# EAGLE design FanController_v1 (EAGLE 6.4)
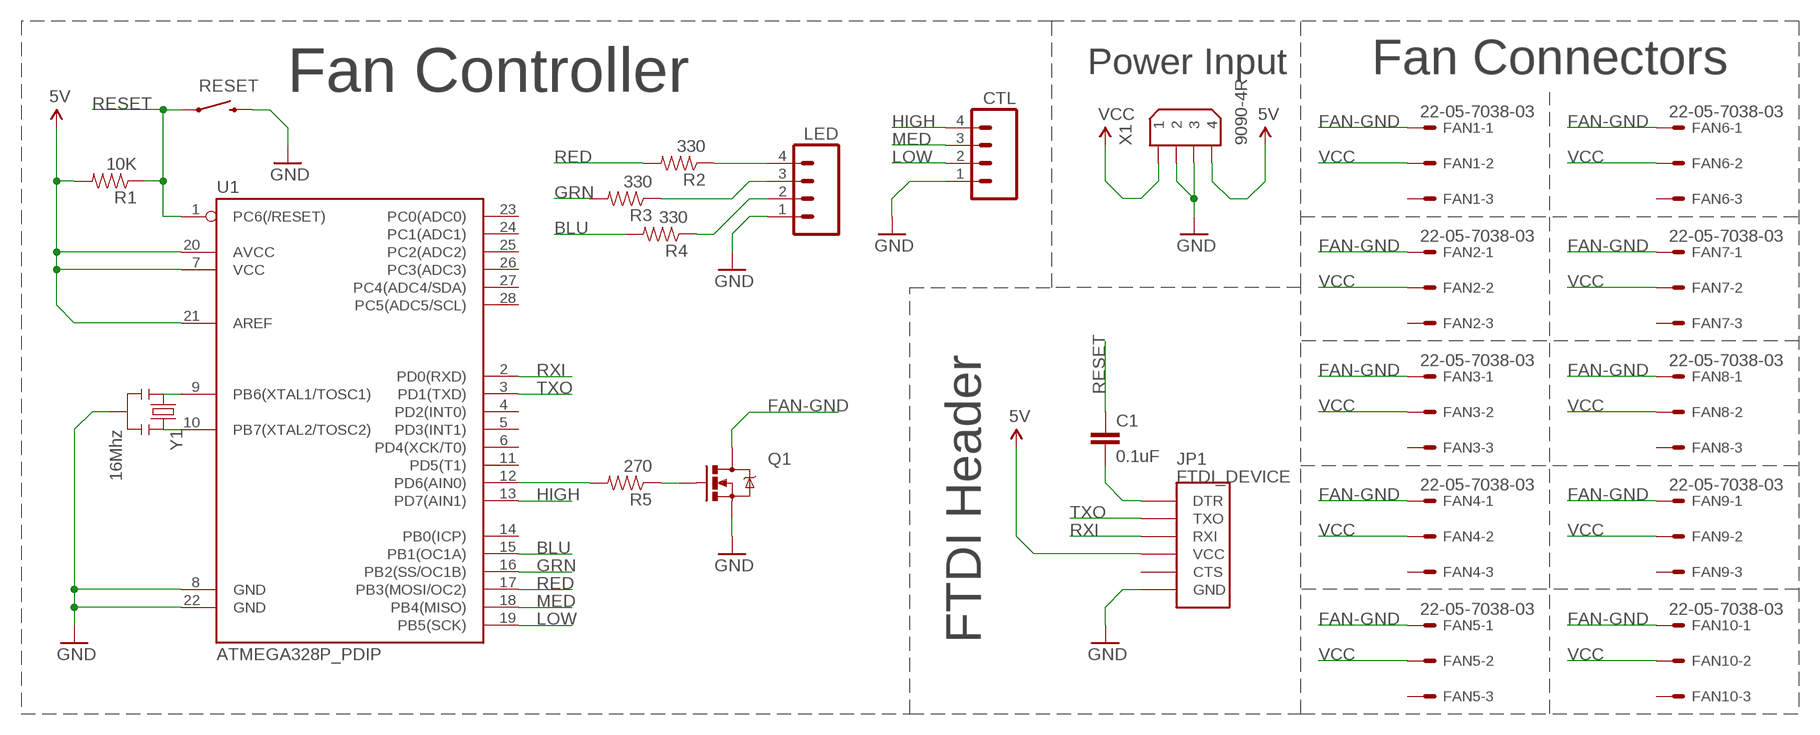
[diagram p0: schematic, sheet 1]

## Parts
C1  0.1uF  CAPPTH  [CAP-PTH-SMALL]
CTL  M04PTH  [1X04]
FAN1  22-05-7038-03  [7395-03]
FAN2  22-05-7038-03  [7395-03]
FAN3  22-05-7038-03  [7395-03]
FAN4  22-05-7038-03  [7395-03]
FAN5  22-05-7038-03  [7395-03]
FAN6  22-05-7038-03  [7395-03]
FAN7  22-05-7038-03  [7395-03]
FAN8  22-05-7038-03  [7395-03]
FAN9  22-05-7038-03  [7395-03]
FAN10  22-05-7038-03  [7395-03]
JP1  FTDI_DEVICE  [FTDI_DEVICE_SIDE]
LED  M04PTH  [1X04]
Q1  MOSFET-NCHANNELFQP30N06L  [TO220V]
R1  10K  RESISTORPTH-1/4W  [AXIAL-0.4]
R2  330  RESISTORPTH-1/4W  [AXIAL-0.4]
R3  330  RESISTORPTH-1/4W  [AXIAL-0.4]
R4  330  RESISTORPTH-1/4W  [AXIAL-0.4]
R5  270  RESISTORPTH-1/4W  [AXIAL-0.4]
RESET  SWITCH-MOMENTARY-2PTH  [TACTILE-PTH]
U1  ATMEGA328P_PDIP  [DIL28-3]
X1  9090-4R  [9090-4R]
Y1  16Mhz  RESONATORPTH  [RESONATOR-PTH]

## Nets
5V: JP1.P$4(VCC) R1.P$2 U1.7(VCC) U1.20(AVCC) U1.21(AREF) X1.4
BLU: R4.P$2 U1.15(PB1(OC1A))
FAN-GND: FAN1.1 FAN2.1 FAN3.1 FAN4.1 FAN5.1 FAN6.1 FAN7.1 FAN8.1 FAN9.1 FAN10.1 Q1.2(D)
GND: CTL.1 JP1.P$6(GND) LED.1 Q1.3(S) RESET.3 U1.8(GND) U1.22(GND) X1.2 X1.3 Y1.2
GRN: R3.P$2 U1.16(PB2(SS/OC1B))
HIGH: CTL.4 U1.13(PD7(AIN1))
LOW: CTL.2 U1.19(PB5(SCK))
MED: CTL.3 U1.18(PB4(MISO))
N$1: U1.10(PB7(XTAL2/TOSC2)) Y1.3
N$2: U1.9(PB6(XTAL1/TOSC1)) Y1.1
N$3: C1.2 JP1.P$1(DTR)
N$4: LED.4 R2.P$1
N$5: LED.3 R3.P$1
N$6: LED.2 R4.P$1
N$7: R5.P$2 U1.12(PD6(AIN0))
N$8: Q1.1(G) R5.P$1
RED: R2.P$2 U1.17(PB3(MOSI/OC2))
RESET: C1.1 R1.P$1 RESET.1 U1.1(PC6(/RESET))
RXI: JP1.P$3(RXI) U1.2(PD0(RXD))
TXO: JP1.P$2(TXO) U1.3(PD1(TXD))
VCC: FAN1.2 FAN2.2 FAN3.2 FAN4.2 FAN5.2 FAN6.2 FAN7.2 FAN8.2 FAN9.2 FAN10.2 X1.1
Unconnected: FAN1.3 FAN2.3 FAN3.3 FAN4.3 FAN5.3 FAN6.3 FAN7.3 FAN8.3 FAN9.3 FAN10.3 JP1.P$5(CTS) U1.4(PD2(INT0)) U1.5(PD3(INT1)) U1.6(PD4(XCK/T0)) U1.11(PD5(T1)) U1.14(PB0(ICP)) U1.23(PC0(ADC0)) U1.24(PC1(ADC1)) U1.25(PC2(ADC2)) U1.26(PC3(ADC3)) U1.27(PC4(ADC4/SDA)) U1.28(PC5(ADC5/SCL))

## Notes on the sheet
- Power Input | Fan Connectors
- Fan Controller
- FTDI Header

## Library data of the parts
C1 = SparkFun-Capacitors:CAP: Capacitor Standard 0603 ceramic capacitor, and 0.1" leaded capacitor.
CTL LED = SparkFun-Connectors:M04: Header 4 Standard 4-pin 0.1" header. Use with straight break away headers (SKU : PRT-00116), right angle break away headers (PRT-00553), swiss pins (PRT-00743), machine pins (PRT-00117), and female headers (PRT-00115). Molex polarized connector foot print use with SKU : PRT-08231 with associated crimp pins and housings. 1MM SMD Version SKU: PRT-10208
FAN1-FAN10 = con-molex:22-?-03: CONNECTOR wire to board 2.54 mm (.1 inch) pitch header; OC_FARNELL: unknown; OC_NEWARK: unknown
JP1 = SparkFun-Connectors:FTDI_DEVICE: Connector which mates to FTDI basic or FTDI cable.
Q1 = SparkFun-DiscreteSemi:MOSFET-NCHANNEL: Common NMOSFET Parts MFG P/N Store ID Prod ID FDD8780 TRANS-09984 SI7820DN TRANS-11055 FDS6630A IC-08089 2N7002PW TRANS-11151 FQP30N06L COM-10213 TRANS-10060 BSS123LT1G TRANS-08345 BSS138 TRANS-00830 BS170 2N7000; PROD_ID: TRANS-10060
R1-R5 = SparkFun-Passives:RESISTOR: Resistor Basic schematic elements and footprints for 0603, 1206, and PTH resistors.
RESET = SparkFun-Electromechanical:SWITCH-MOMENTARY-2: Various NO switches- pushbuttons, reed, etc
U1 = SparkFun-DigitalIC:ATMEGA328P_PDIP: uC used in the Arduino 32kb flash, 1k EEPROM, 2k SRAM This is the through-hole version of this chip.
X1 = con-thomas-betts:9090-4: Disk Drive Power four position Source: Thomas & Betts Electronic Interconnects Eiropean Edition 1998; OC_FARNELL: unknown; OC_NEWARK: unknown
Y1 = SparkFun-FreqCtrl:RESONATOR: Resonator Small SMD resonator. Used, eg, on the Arduino Pro/ Pro Mini boards. 8MHz- XTAL-08895 16MHz- XTAL-08900

## Board
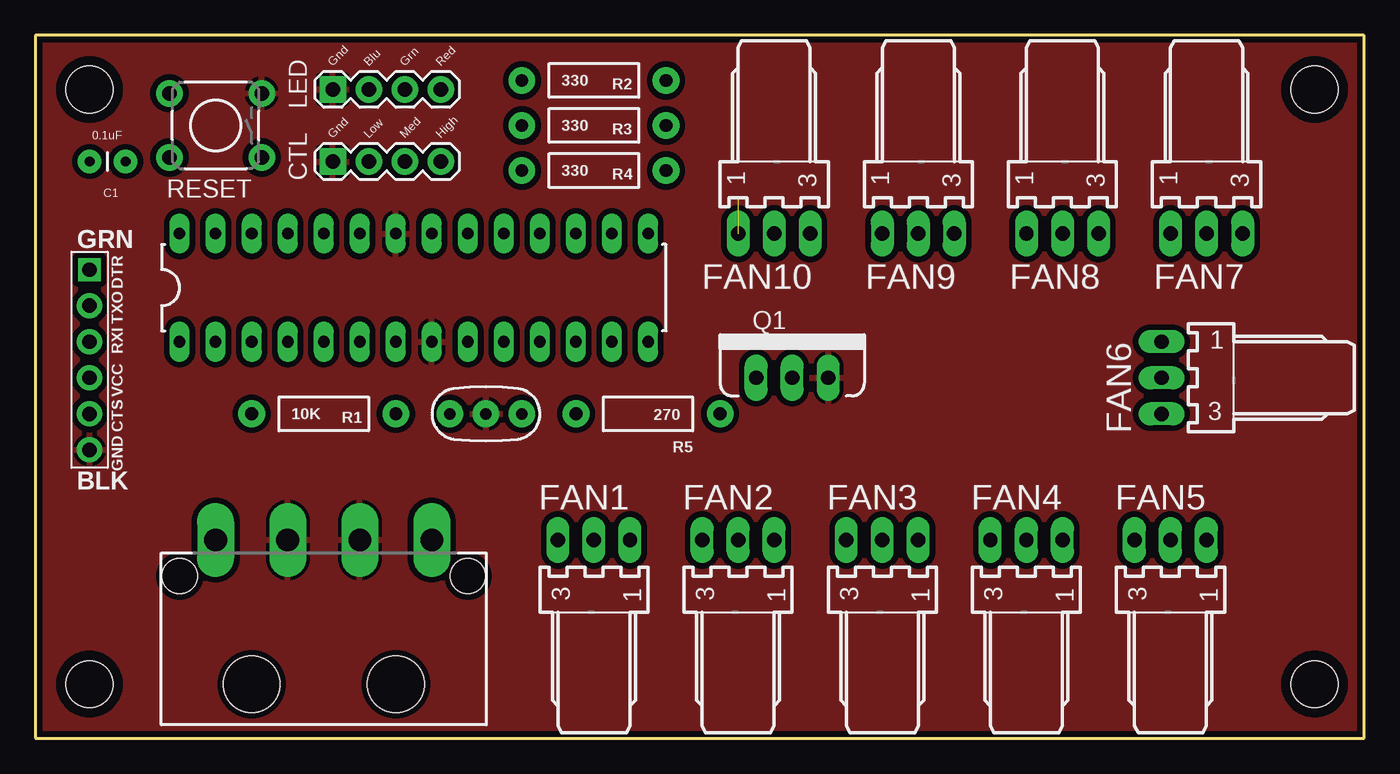
[diagram p1: board, top side]
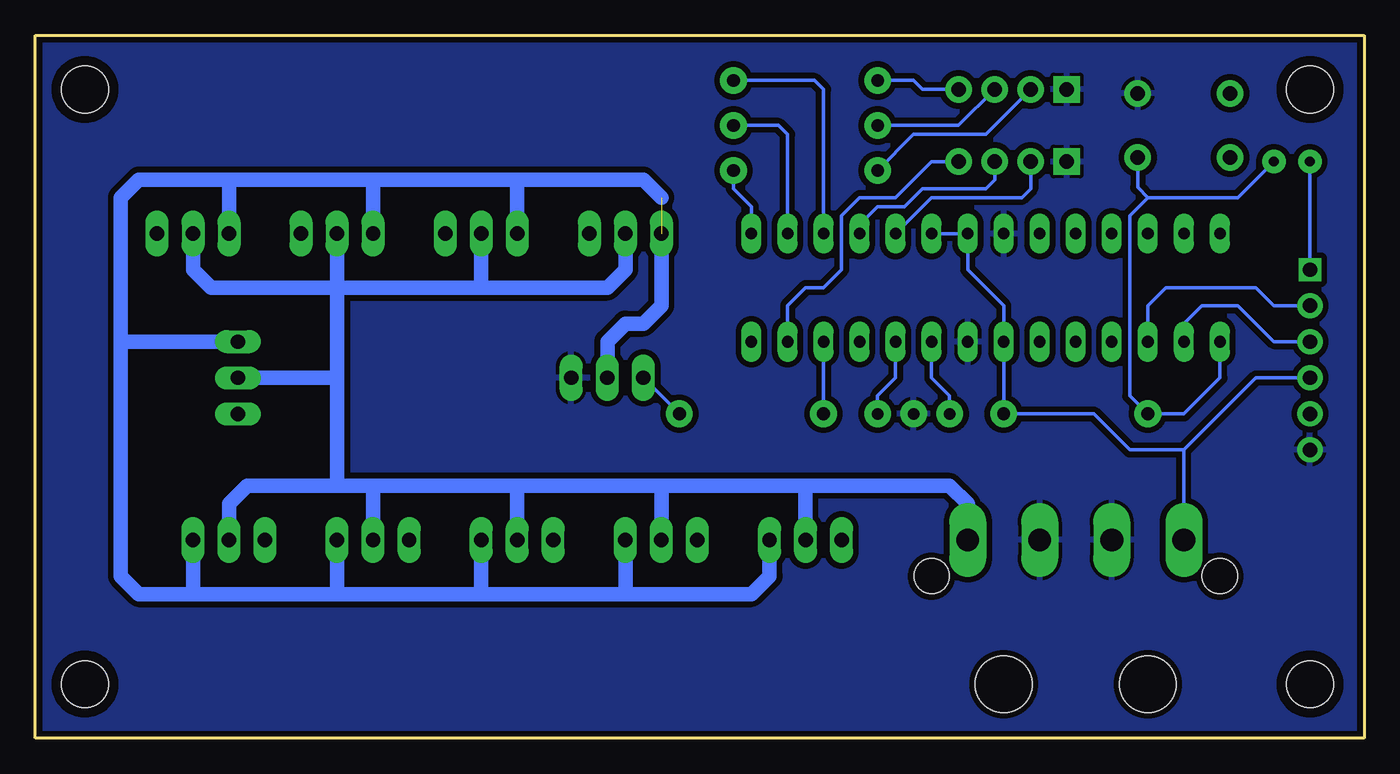
[diagram p2: board, bottom side, seen from below]

Size 93.65 x 49.52 mm. Coordinates in mm from the lower left corner, seen from the top.
Outline: 0,0 93.65,0 93.65,49.52 0,49.52 0,0
Copper layers (1*16): Top 0.035mm / dielectric 1.5mm / Bottom 0.035mm
Design rules "SparkFun": minimum track width 8mil, minimum drill 20mil, track to track 8mil, track to pad 8mil, pad to pad 8mil, via to via 8mil, smd to smd 8mil, copper to edge 10mil, drill to drill 8mil, minimum pad ring 12mil, minimum via ring 10mil, stop-mask expansion 4mil, vias tented up to drill 25mil, thermal gap 10mil

### Footprints (pad centres in the part's own frame; a part is rotated, then mirrored left to right if it is on the bottom)
CAP-PTH-SMALL = drill 0.7 pad 1.651: 1 0,0; 2 2.54,0
1X04 = drill 1.016 pad 1.88 square: 1 0,0 | drill 1.016 pad 1.88: 2 2.54,0; 3 5.08,0; 4 7.62,0
7395-03 = drill 1.016 long: 1 2.54,0; 2 0,0; 3 -2.54,0
FTDI_DEVICE_SIDE = drill 1 square: P$1 -6.35,0 | drill 1.016 pad 1.778: P$2 -3.81,0; P$3 -1.27,0; P$4 1.27,0; P$5 3.81,0; P$6 6.35,0
TO220V = drill 1.016 long: 1 -2.54,0; 2 0,0; 3 2.54,0
AXIAL-0.4 = drill 0.9 pad 1.88: P$1 -5.08,0; P$2 5.08,0
TACTILE-PTH = drill 1.016 pad 1.88: 1 -3.251,2.261; 2 3.251,2.261; 3 -3.251,-2.261; 4 3.251,-2.261
DIL28-3 = drill 0.813 long: 1 -16.51,-3.81; 2 -13.97,-3.81; 3 -11.43,-3.81; 4 -8.89,-3.81; 5 -6.35,-3.81; 6 -3.81,-3.81; 7 -1.27,-3.81; 8 1.27,-3.81; 9 3.81,-3.81; 10 6.35,-3.81; 11 8.89,-3.81; 12 11.43,-3.81; 13 13.97,-3.81; 14 16.51,-3.81; 15 16.51,3.81; 16 13.97,3.81; 17 11.43,3.81; 18 8.89,3.81; 19 6.35,3.81; 20 3.81,3.81; 21 1.27,3.81; 22 -1.27,3.81; 23 -3.81,3.81; 24 -6.35,3.81; 25 -8.89,3.81; 26 -11.43,3.81; 27 -13.97,3.81; 28 -16.51,3.81
STAND-OFF = hole 3.302: 0,0
9090-4R = drill 1.6 pad 2.6 long: 1 -7.62,-6.35; 2 -2.54,-6.35; 3 2.54,-6.35; 4 7.62,-6.35 | hole 4: -5.08,3.81; 5.08,3.81 | hole 2.5: -10.16,-3.81; 10.16,-3.81
RESONATOR-PTH = drill 0.8 pad 1.88: 1 -2.54,0; 2 0,0; 3 2.54,0

### Placement (x,y rotation side)
C1  6.35,40.64 180 top
CTL  20.95,40.64 0 top
FAN1  39.37,13.97 0 top
FAN2  49.53,13.97 0 top
FAN3  59.69,13.97 0 top
FAN4  69.85,13.97 0 top
FAN5  80.01,13.97 0 top
FAN6  79.38,25.4 90 top
FAN7  82.55,35.56 180 top
FAN8  72.39,35.56 180 top
FAN9  62.23,35.56 180 top
FAN10  52.07,35.56 180 top
JP1  3.81,26.67 270 top
LED  20.95,45.72 0 top
Q1  53.34,25.4 0 top
R1  20.32,22.86 0 top
R2  39.37,46.35 0 top
R3  39.37,43.18 0 top
R4  39.37,40.01 0 top
R5  43.18,22.86 180 top
RESET  12.7,43.18 180 top
U1  26.67,31.75 0 top
U$1  [STAND-OFF]  3.81,45.72 0 top
U$2  [STAND-OFF]  90.17,3.81 0 top
U$3  [STAND-OFF]  3.81,3.81 0 top
U$4  [STAND-OFF]  90.17,45.72 0 top
X1  20.32,7.62 180 top
Y1  31.75,22.86 0 top

### Tracks (layer width: path | path; a pad name or v marks a point on that pad's centre or on a via)
5V
  Bottom 0.254: U1.20 U1.21 27.94,33.02 25.4,30.48 U1.7 R1.P$2 19.05,22.86 16.51,20.32 12.7,20.32 | X1.4 12.7,20.32 | 12.7,20.32 7.62,25.4 JP1.P$4
BLU
  Bottom 0.254: U1.15 43.18,37.47 44.45,38.73 R4.P$2
FAN-GND  (1 unrouted)
  Bottom 1.016: Q1.2 53.34,27.94 52.07,29.21 50.8,29.21 49.53,30.48 FAN10.1 | 49.53,38.1 50.8,39.37 59.69,39.37 | 59.69,39.37 69.85,39.37 | 69.85,39.37 80.01,39.37 | 80.01,39.37 86.36,39.37 87.63,38.1 87.63,27.94 | 87.63,27.94 87.63,11.43 86.36,10.16 82.55,10.16 | 82.55,10.16 72.39,10.16 | 72.39,10.16 62.23,10.16 | 62.23,10.16 52.07,10.16 | 52.07,10.16 43.18,10.16 41.91,11.43 FAN1.1 | FAN2.1 52.07,10.16 | FAN3.1 62.23,10.16 | FAN4.1 72.39,10.16 | FAN5.1 82.55,10.16 | FAN6.1 87.63,27.94 | FAN7.1 80.01,39.37 | FAN8.1 69.85,39.37 | FAN9.1 59.69,39.37
GND
  pour Bottom (isolate 0.406): -1.27,-1.27 95.25,-1.27 95.25,50.8 -1.27,50.8
  pour Top (isolate 0.406): -2.54,52.07 96.52,52.07 96.52,-2.54 -2.54,-2.54
GRN
  Bottom 0.254: U1.16 40.64,42.55 41.27,43.18 R3.P$2
HIGH
  Bottom 0.254: CTL.4 30.48,40.64 33.02,38.1 35.56,38.1 36.83,36.83 36.83,33.02 38.1,31.75 39.37,31.75 40.64,30.48 U1.13
LOW
  Bottom 0.254: CTL.2 23.5,38.73 24.13,38.1 30.48,38.1 U1.19
MED
  Bottom 0.254: U1.18 35.56,36.2 34.29,37.47 32.38,37.47 31.11,38.73 26.67,38.73 26.04,39.37 CTL.3
N$1
  Bottom 0.254: U1.10 33.02,25.4 34.29,24.13 Y1.3
N$2
  Bottom 0.254: U1.9 30.48,25.4 29.21,24.13 Y1.1
N$3
  Bottom 0.254: JP1.P$1 C1.2
N$4
  Bottom 0.254: R2.P$1 31.75,46.35 31.11,45.72 LED.4
N$5
  Bottom 0.254: LED.3 28.57,43.18 R3.P$1
N$6
  Bottom 0.254: LED.2 26.67,42.55 31.75,42.55 R4.P$1
N$7
  Bottom 0.254: U1.12 R5.P$2
N$8
  Bottom 0.254: R5.P$1 Q1.1
RED
  Bottom 0.254: U1.17 38.1,45.72 38.73,46.35 R2.P$2
RESET
  Bottom 0.254: U1.1 10.16,25.4 12.7,22.86 R1.P$1 16.51,24.13 16.51,36.83 15.24,38.1 | C1.1 8.89,38.1 15.24,38.1 | RESET.1 15.95,38.81 15.24,38.1
RXI
  Bottom 0.254: U1.2 12.7,29.21 11.43,30.48 8.89,30.48 6.35,27.94 JP1.P$3
TXO
  Bottom 0.254: JP1.P$2 6.35,30.48 7.62,31.75 13.97,31.75 15.24,30.48 U1.3
VCC
  Bottom 1.016: X1.1 27.94,16.51 29.21,17.78 39.37,17.78 | 39.37,17.78 49.53,17.78 | 49.53,17.78 59.69,17.78 | 59.69,17.78 69.85,17.78 | 69.85,17.78 72.39,17.78 | 72.39,17.78 78.74,17.78 80.01,16.51 FAN5.2 | FAN4.2 69.85,17.78 | FAN3.2 59.69,17.78 | FAN2.2 49.53,17.78 | FAN1.2 39.37,17.78 | 72.39,31.75 72.39,25.4 | 72.39,25.4 72.39,17.78 | 72.39,31.75 62.23,31.75 | 62.23,31.75 53.34,31.75 52.07,33.02 FAN10.2 | FAN6.2 72.39,25.4 | FAN9.2 62.23,31.75 | FAN8.2 72.39,31.75 | FAN7.2 82.55,33.02 81.28,31.75 72.39,31.75

### Text on the board
tPlace: Gnd | Blu | Grn | Red | Gnd | Low | Med | High